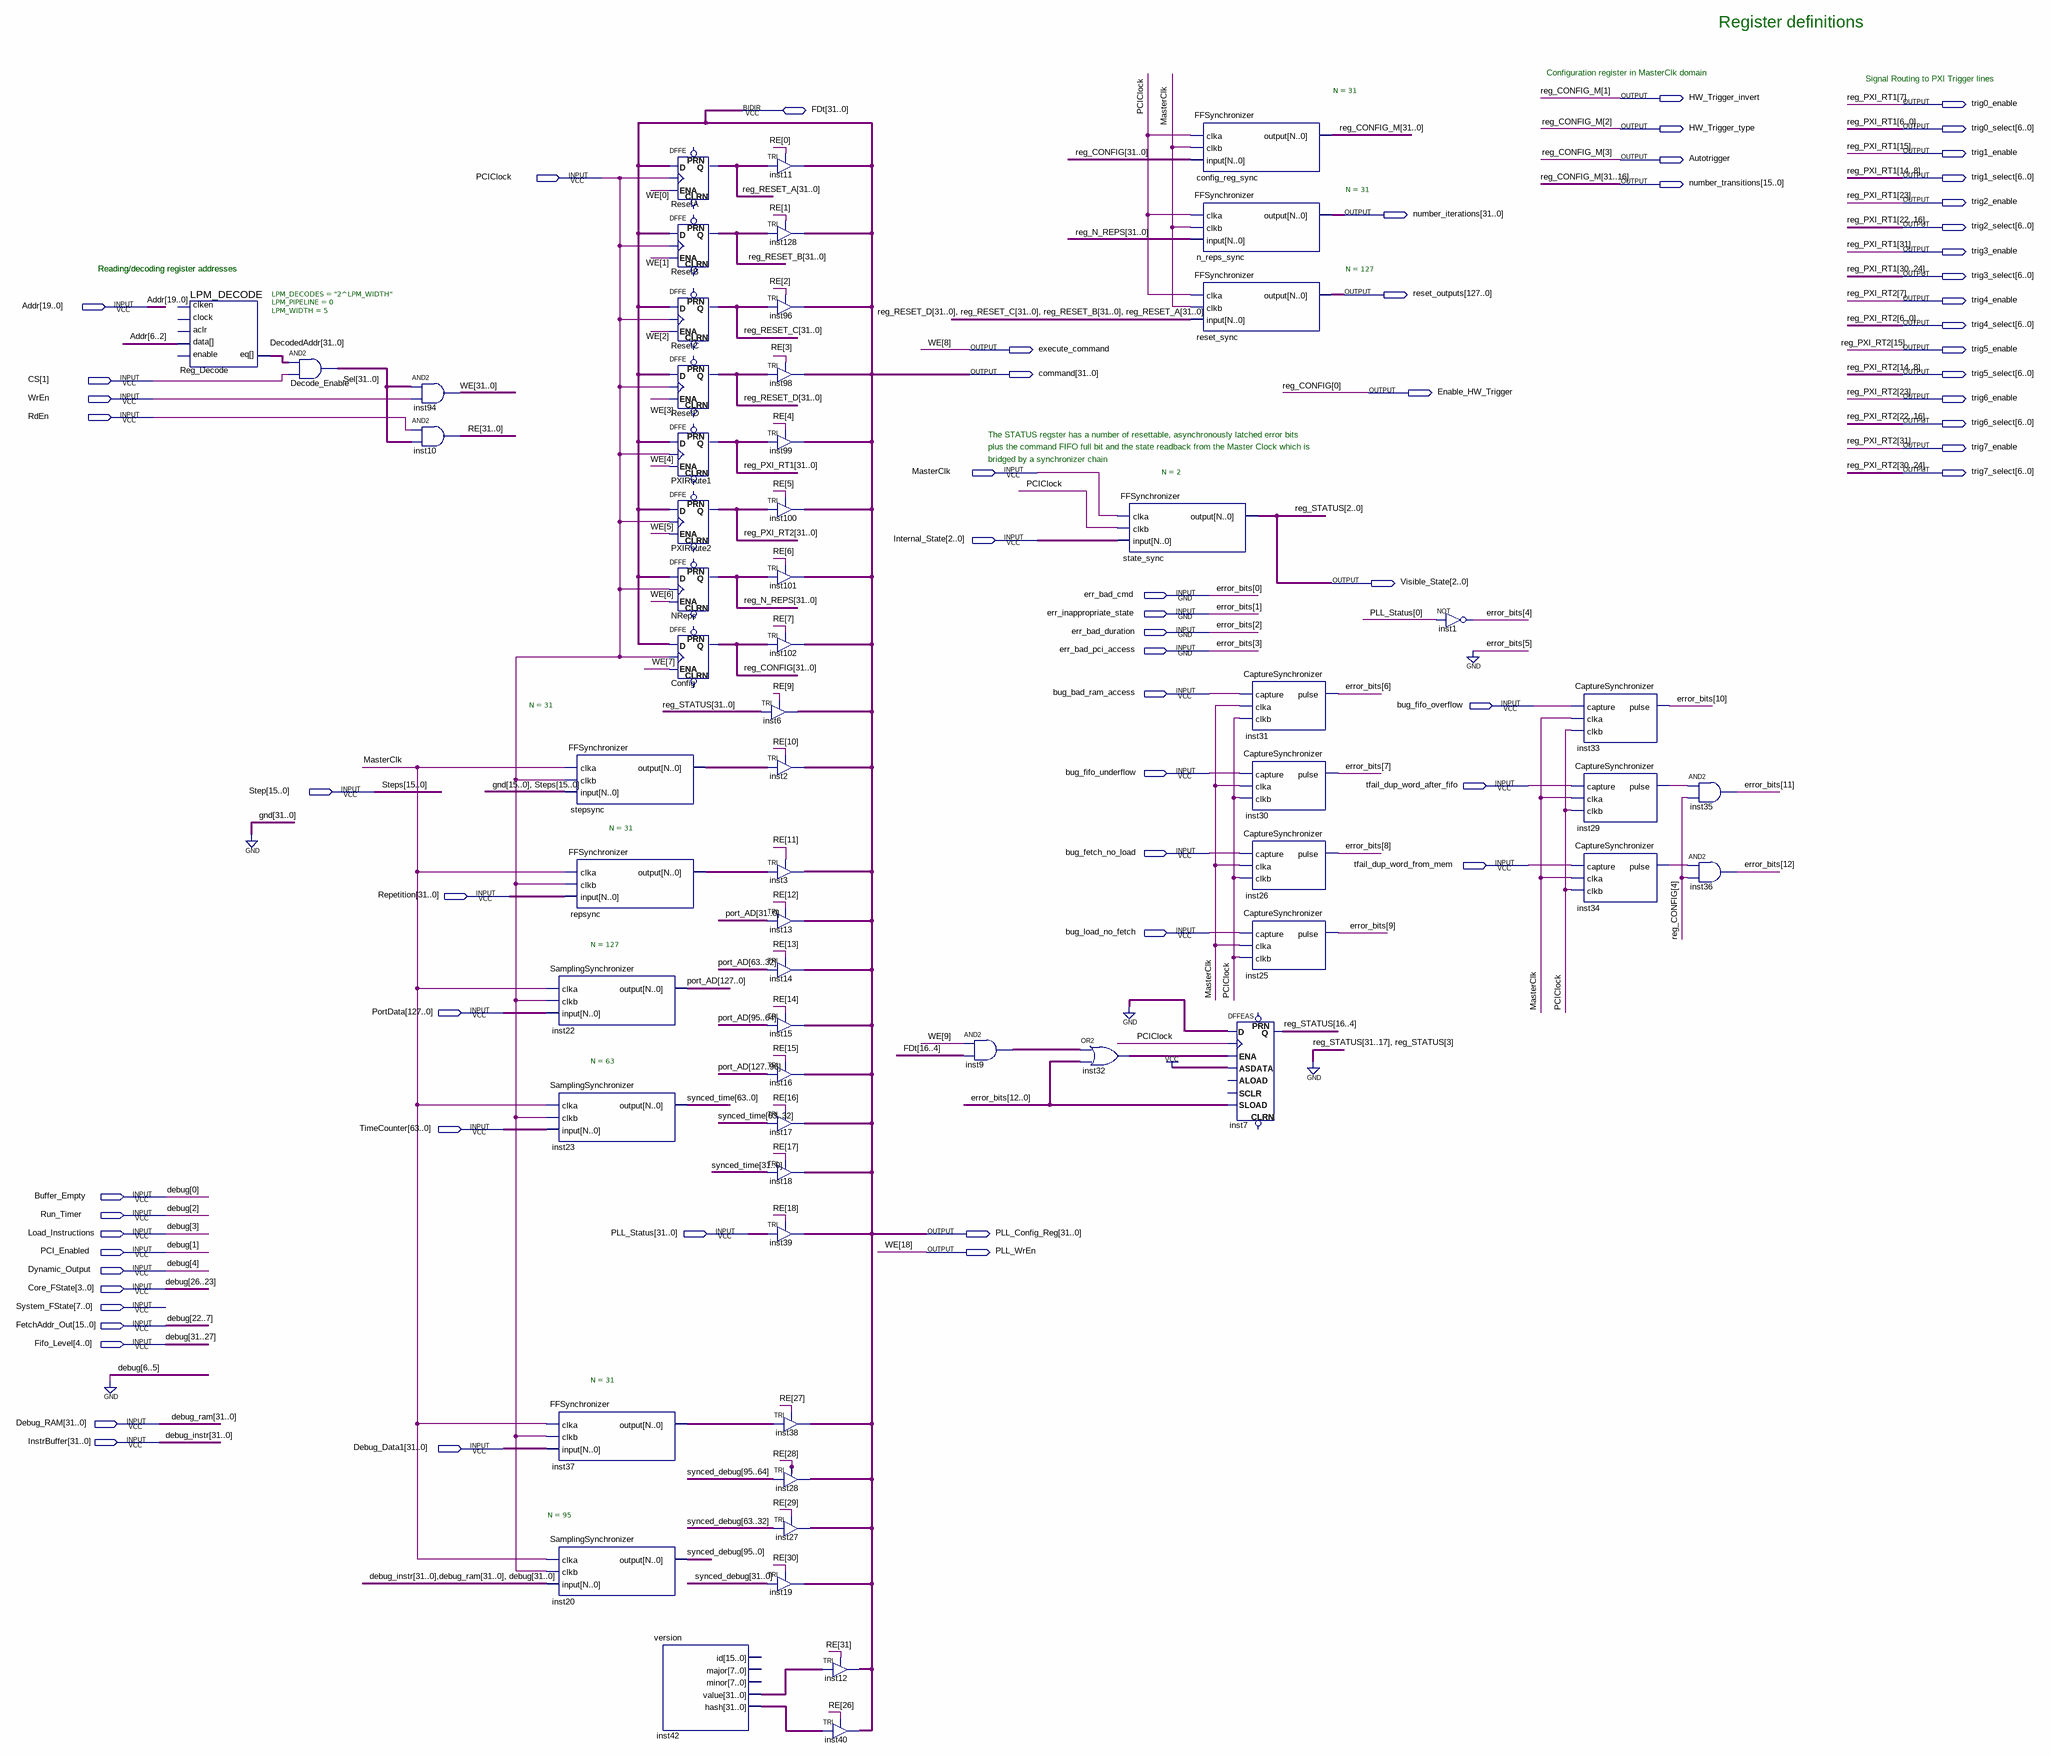
[diagram p0: schematic sheet]
// Quartus schematic Registers.bdf as structural Verilog: 60 symbols, 64 pins
module Registers (
  input  PCIClock,
  input  [19:0] Addr,
  input  [1:1] CS,
  input  WrEn,
  input  RdEn,
  input  MasterClk,
  input  [2:0] Internal_State,
  input  err_bad_cmd,
  input  err_inappropriate_state,
  input  err_bad_duration,
  input  err_bad_pci_access,
  input  bug_bad_ram_access,
  input  bug_fifo_overflow,
  input  bug_fifo_underflow,
  input  tfail_dup_word_after_fifo,
  input  [15:0] Step,
  input  bug_fetch_no_load,
  input  tfail_dup_word_from_mem,
  input  [31:0] Repetition,
  input  bug_load_no_fetch,
  input  [127:0] PortData,
  input  [63:0] TimeCounter,
  input  Buffer_Empty,
  input  Run_Timer,
  input  Load_Instructions,
  input  [31:0] PLL_Status,
  input  PCI_Enabled,
  input  Dynamic_Output,
  input  [3:0] Core_FState,
  input  [7:0] System_FState,
  input  [15:0] FetchAddr_Out,
  input  [4:0] Fifo_Level,
  input  [31:0] Debug_RAM,
  input  [31:0] InstrBuffer,
  input  [31:0] Debug_Data1,
  inout  [31:0] FDt,
  output HW_Trigger_invert,
  output trig0_enable,
  output HW_Trigger_type,
  output [6:0] trig0_select,
  output trig1_enable,
  output Autotrigger,
  output [6:0] trig1_select,
  output [15:0] number_transitions,
  output trig2_enable,
  output [31:0] number_iterations,
  output [6:0] trig2_select,
  output trig3_enable,
  output [6:0] trig3_select,
  output [127:0] reset_outputs,
  output trig4_enable,
  output [6:0] trig4_select,
  output execute_command,
  output trig5_enable,
  output [31:0] command,
  output [6:0] trig5_select,
  output Enable_HW_Trigger,
  output trig6_enable,
  output [6:0] trig6_select,
  output trig7_enable,
  output [6:0] trig7_select,
  output [2:0] Visible_State,
  output [31:0] PLL_Config_Reg,
  output PLL_WrEn
);

  wire inst29_pulse, inst34_pulse;
  wire [6:5] debug;
  wire [12:0] inst9_out, inst32_out;
  wire [12:4] error_bits;
  wire [15:0] reg_CONFIG_M;
  wire [16:4] reg_STATUS;
  wire [31:0] DecodedAddr, inst37_output, inst42_hash, inst42_value, RE, reg_N_REPS, reg_RESET_A,
       reg_RESET_B, reg_RESET_C, reg_RESET_D, repsync_output, Sel, stepsync_output, WE;
  wire [31:1] reg_CONFIG;
  wire [63:0] synced_time;
  wire [95:0] synced_debug;
  wire [127:0] port_AD;

  LPM_DECODE #(.LPM_DECODES("2^LPM_WIDTH"), .LPM_PIPELINE(0), .LPM_WIDTH(5)) Reg_Decode (
    .data(Addr[6:2]), .eq(DecodedAddr));  // open: enable, clken, clock, aclr
  assign Sel = DecodedAddr & {32{CS[1]}};  // AND2 Decode_Enable, 32 bits wide
  assign {WE[31:19], PLL_WrEn, WE[17:9], execute_command, WE[7:0]} = Sel & {32{WrEn}};  // AND2 inst94, 32 bits wide
  assign RE = {32{RdEn}} & Sel;  // AND2 inst10, 32 bits wide
  SamplingSynchronizer #(.N(127)) inst22 (.clka(MasterClk), .clkb(PCIClock), .\input (PortData), .\output (port_AD));
  SamplingSynchronizer #(.N(63)) inst23 (
    .clka(MasterClk), .clkb(PCIClock), .\input (TimeCounter), .\output (synced_time));
  FFSynchronizer #(.N(31)) inst37 (.clka(MasterClk), .clkb(PCIClock), .\input (Debug_Data1), .\output (inst37_output));
  SamplingSynchronizer #(.N(95)) inst20 (
    .clka(MasterClk), .clkb(PCIClock),
    .\input ({InstrBuffer, Debug_RAM, Fifo_Level, Core_FState, FetchAddr_Out, debug, Dynamic_Output, Load_Instructions, Run_Timer, PCI_Enabled, Buffer_Empty}),
    .\output (synced_debug));
  FFSynchronizer #(.N(31)) stepsync (
    .clka(MasterClk), .clkb(PCIClock), .\input ({{16{1'b0}}, Step}), .\output (stepsync_output));
  FFSynchronizer #(.N(31)) repsync (.clka(MasterClk), .clkb(PCIClock), .\input (Repetition), .\output (repsync_output));
  DFFE ResetA[31:0] (.D(FDt), .CLK(PCIClock), .ENA(WE[0]), .Q(reg_RESET_A));  // open: PRN, CLRN
  DFFE ResetB[31:0] (.D(FDt), .CLK(PCIClock), .ENA(WE[1]), .Q(reg_RESET_B));  // open: PRN, CLRN
  DFFE ResetC[31:0] (.D(FDt), .CLK(PCIClock), .ENA(WE[2]), .Q(reg_RESET_C));  // open: PRN, CLRN
  DFFE ResetD[31:0] (.D(FDt), .CLK(PCIClock), .ENA(WE[3]), .Q(reg_RESET_D));  // open: PRN, CLRN
  DFFE PXIRoute1[31:0] (
    .D(FDt), .CLK(PCIClock), .ENA(WE[4]),
    .Q({trig3_enable, trig3_select, trig2_enable, trig2_select, trig1_enable, trig1_select, trig0_enable, trig0_select}));  // open: PRN, CLRN
  DFFE PXIRoute2[31:0] (
    .D(FDt), .CLK(PCIClock), .ENA(WE[5]),
    .Q({trig7_enable, trig7_select, trig6_enable, trig6_select, trig5_enable, trig5_select, trig4_enable, trig4_select}));  // open: PRN, CLRN
  DFFE NReps[31:0] (.D(FDt), .CLK(PCIClock), .ENA(WE[6]), .Q(reg_N_REPS));  // open: PRN, CLRN
  DFFE Config[31:0] (.D(FDt), .CLK(PCIClock), .ENA(WE[7]), .Q({reg_CONFIG, Enable_HW_Trigger}));  // open: PRN, CLRN
  version inst42 (.value(inst42_value), .hash(inst42_hash));  // open: id, major, minor
  TRI inst11[31:0] (.IN(reg_RESET_A), .OE(RE[0]), .OUT(FDt));
  TRI inst128[31:0] (.IN(reg_RESET_B), .OE(RE[1]), .OUT(FDt));
  TRI inst96[31:0] (.IN(reg_RESET_C), .OE(RE[2]), .OUT(FDt));
  TRI inst98[31:0] (.IN(reg_RESET_D), .OE(RE[3]), .OUT(FDt));
  TRI inst99[31:0] (
    .IN({trig3_enable, trig3_select, trig2_enable, trig2_select, trig1_enable, trig1_select, trig0_enable, trig0_select}),
    .OE(RE[4]), .OUT(FDt));
  TRI inst100[31:0] (
    .IN({trig7_enable, trig7_select, trig6_enable, trig6_select, trig5_enable, trig5_select, trig4_enable, trig4_select}),
    .OE(RE[5]), .OUT(FDt));
  TRI inst101[31:0] (.IN(reg_N_REPS), .OE(RE[6]), .OUT(FDt));
  TRI inst102[31:0] (.IN({reg_CONFIG, Enable_HW_Trigger}), .OE(RE[7]), .OUT(FDt));
  TRI inst6[31:0] (.IN({{15{1'b0}}, reg_STATUS, 1'b0, Visible_State}), .OE(RE[9]), .OUT(FDt));
  TRI inst2[31:0] (.IN(stepsync_output), .OE(RE[10]), .OUT(FDt));
  TRI inst3[31:0] (.IN(repsync_output), .OE(RE[11]), .OUT(FDt));
  TRI inst13[31:0] (.IN(port_AD[31:0]), .OE(RE[12]), .OUT(FDt));
  TRI inst14[31:0] (.IN(port_AD[63:32]), .OE(RE[13]), .OUT(FDt));
  TRI inst15[31:0] (.IN(port_AD[95:64]), .OE(RE[14]), .OUT(FDt));
  TRI inst16[31:0] (.IN(port_AD[127:96]), .OE(RE[15]), .OUT(FDt));
  TRI inst17[31:0] (.IN(synced_time[63:32]), .OE(RE[16]), .OUT(FDt));
  TRI inst18[31:0] (.IN(synced_time[31:0]), .OE(RE[17]), .OUT(FDt));
  TRI inst39[31:0] (.IN(PLL_Status), .OE(RE[18]), .OUT(FDt));
  TRI inst38[31:0] (.IN(inst37_output), .OE(RE[27]), .OUT(FDt));
  TRI inst28[31:0] (.IN(synced_debug[95:64]), .OE(RE[28]), .OUT(FDt));
  TRI inst27[31:0] (.IN(synced_debug[63:32]), .OE(RE[29]), .OUT(FDt));
  TRI inst19[31:0] (.IN(synced_debug[31:0]), .OE(RE[30]), .OUT(FDt));
  TRI inst12[31:0] (.IN(inst42_value), .OE(RE[31]), .OUT(FDt));
  TRI inst40[31:0] (.IN(inst42_hash), .OE(RE[26]), .OUT(FDt));
  assign inst9_out = {13{WE[9]}} & FDt[16:4];  // AND2 inst9, 13 bits wide
  assign inst32_out = inst9_out | {error_bits[12:6], 1'b0, error_bits[4], err_bad_pci_access, err_bad_duration, err_inappropriate_state, err_bad_cmd};  // OR2 inst32, 13 bits wide
  FFSynchronizer #(.N(2)) state_sync (
    .clka(MasterClk), .clkb(PCIClock), .\input (Internal_State), .\output (Visible_State));
  FFSynchronizer #(.N(31)) config_reg_sync (
    .clka(PCIClock), .clkb(MasterClk), .\input ({reg_CONFIG, Enable_HW_Trigger}),
    .\output ({number_transitions, reg_CONFIG_M[15:4], Autotrigger, HW_Trigger_type, HW_Trigger_invert, reg_CONFIG_M[0]}));
  FFSynchronizer #(.N(31)) n_reps_sync (
    .clka(PCIClock), .clkb(MasterClk), .\input (reg_N_REPS), .\output (number_iterations));
  FFSynchronizer #(.N(127)) reset_sync (
    .clka(PCIClock), .clkb(MasterClk), .\input ({reg_RESET_D, reg_RESET_C, reg_RESET_B, reg_RESET_A}),
    .\output (reset_outputs));
  DFFEAS inst7[12:0] (
    .ASDATA({13{1'b1}}), .ENA(inst32_out), .CLK(PCIClock), .D({13{1'b0}}),
    .SLOAD({error_bits[12:6], 1'b0, error_bits[4], err_bad_pci_access, err_bad_duration, err_inappropriate_state, err_bad_cmd}),
    .Q(reg_STATUS));  // open: PRN, ALOAD, CLRN, SCLR
  CaptureSynchronizer inst31 (.capture(bug_bad_ram_access), .clka(MasterClk), .clkb(PCIClock), .pulse(error_bits[6]));
  CaptureSynchronizer inst30 (.capture(bug_fifo_underflow), .clka(MasterClk), .clkb(PCIClock), .pulse(error_bits[7]));
  CaptureSynchronizer inst26 (.capture(bug_fetch_no_load), .clka(MasterClk), .clkb(PCIClock), .pulse(error_bits[8]));
  CaptureSynchronizer inst25 (.capture(bug_load_no_fetch), .clka(MasterClk), .clkb(PCIClock), .pulse(error_bits[9]));
  not inst1 (error_bits[4], PLL_Status[0]);
  CaptureSynchronizer inst33 (.capture(bug_fifo_overflow), .clka(MasterClk), .clkb(PCIClock), .pulse(error_bits[10]));
  CaptureSynchronizer inst29 (
    .capture(tfail_dup_word_after_fifo), .clka(MasterClk), .clkb(PCIClock), .pulse(inst29_pulse));
  CaptureSynchronizer inst34 (
    .capture(tfail_dup_word_from_mem), .clka(MasterClk), .clkb(PCIClock), .pulse(inst34_pulse));
  and inst35 (error_bits[11], inst29_pulse, reg_CONFIG[4]);
  and inst36 (error_bits[12], inst34_pulse, reg_CONFIG[4]);

  assign command = FDt;
  assign PLL_Config_Reg = FDt;

  // Other names for the same wires on the sheet: debug (some bits) = {Fifo_Level, Core_FState, FetchAddr_Out, Dynamic_Output, Load_Instructions, Run_Timer, PCI_Enabled, Buffer_Empty};
  //   debug_instr[31:0] = InstrBuffer;
  //   error_bits[3:0] = {err_bad_pci_access, err_bad_duration, err_inappropriate_state, err_bad_cmd};
  //   reg_CONFIG[0] = Enable_HW_Trigger;
  //   reg_CONFIG_M (some bits) = {number_transitions, Autotrigger, HW_Trigger_type, HW_Trigger_invert};
  //   reg_PXI_RT1[31:0] = {trig3_enable, trig3_select, trig2_enable, trig2_select, trig1_enable, trig1_select, trig0_enable, trig0_select};
  //   reg_PXI_RT2[31:0] = {trig7_enable, trig7_select, trig6_enable, trig6_select, trig5_enable, trig5_select, trig4_enable, trig4_select};
  //   Steps[15:0] = Step; reg_STATUS[2:0] = Visible_State; WE (some bits) = {PLL_WrEn, execute_command}

  // Notes on the sheet:
  //   Register definitions
  //   Configuration register in MasterClk domain
  //   Signal Routing to PXI Trigger lines
  //   Reading/decoding register addresses
  //   Reading/decoding register addresses
  //   The STATUS regster has a number of resettable, asynchronously latched error bits
  //   plus the command FIFO full bit and the state readback from the Master Clock which is
  //   bridged by a synchronizer chain
endmodule
